# Altium schematic sheet SATA.SchDoc
size A
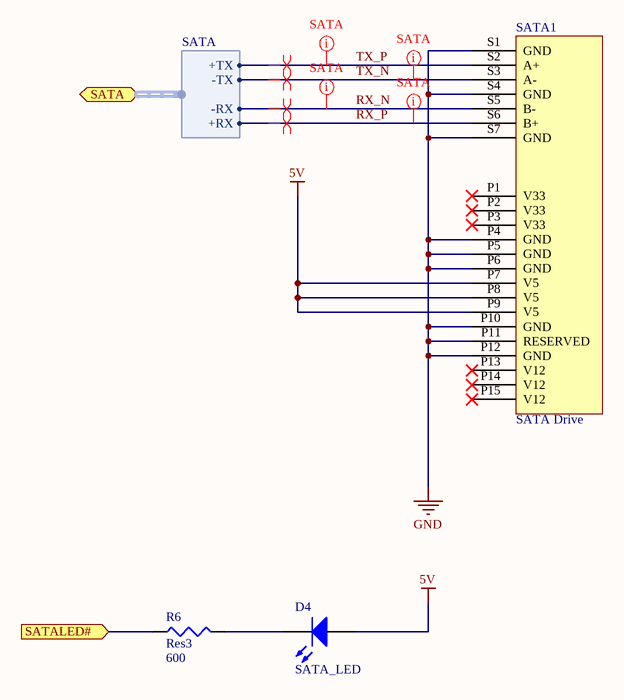
[diagram p0: SATA.SchDoc]

## Parts
D4  SATA_LED  [0805]
R6  Res3  value 600  [J1-0603]
SATA1  SATA Drive  [SATA COMB RECEPTICLE]

## Ports
SATA (harness SATA), SATALED# (in)

## Harnesses
SATA: +TX, -TX, -RX, +RX

## Nets
5V: D4.1(A) SATA1.P7(V5) SATA1.P8(V5) SATA1.P9(V5)
GND: SATA1.P4(GND) SATA1.P5(GND) SATA1.P6(GND) SATA1.P10(GND) SATA1.P11(RESERVED) SATA1.P12(GND) SATA1.S1(GND) SATA1.S4(GND) SATA1.S7(GND)
RX_N: SATA1.S5(B-) ; port SATA.-RX
RX_P: SATA1.S6(B+) ; port SATA.+RX
SATALED#: R6.1 ; port SATALED#
TX_N: SATA1.S3(A-) ; port SATA.-TX
TX_P: SATA1.S2(A+) ; port SATA.+TX
NetD4_2: D4.2(K) R6.2

Not connected (* = marked no-connect by the designer): SATA1 P1(V33)* P2(V33)* P3(V33)* P13(V12)* P14(V12)* P15(V12)*

## Layout directives
differential pair: RX_N, RX_P, TX_N, TX_P
rule Length Constraint [Min Length = 0mil    Max Length = 4000mil]; rule Width Constraint [Pref Width = 5mil    Min Width = 5mil    Max Width = 6mil]; rule Differential Pairs Routing [Pref Gap = 4mil    Min Gap  = 4mil    Max Gap  = 7mil]; rule Maximum Via Count Constraint [Max Count = 4]; rule Matched Net Lengths [Tolerance = 5mil]: RX_N, RX_P, TX_N, TX_P

## Library data of the parts
D4 = LED1: Typical RED GaAs LED; Published: 8-Jun-2000; LatestRevisionDate: 08-Jul-2005; LatestRevisionNote: Mech Layer 1 removed.; PackageReference: LED-1; Publisher: Altium Limited; Supplier Part #: 475-2483-6-ND; Supplier: DigiKey
R6 = Res3: Resistor; Published: 8-Jun-2000; LatestRevisionDate: 04-Mar-2005; LatestRevisionNote: PCB Footprint replaced.; PackageReference: J1-0603; Publisher: Altium Limited; Supplier Part #: P604HCT-ND; Supplier: DigiKey
SATA1 = SATA Drive: SATA HDD, FCI Part# 10029364; Model: 10029364; Supplier: DigiKey; Supplier Part #: 609-1028-ND